# Altium schematic sheet Line_follower_Mark1.SchDoc
size A
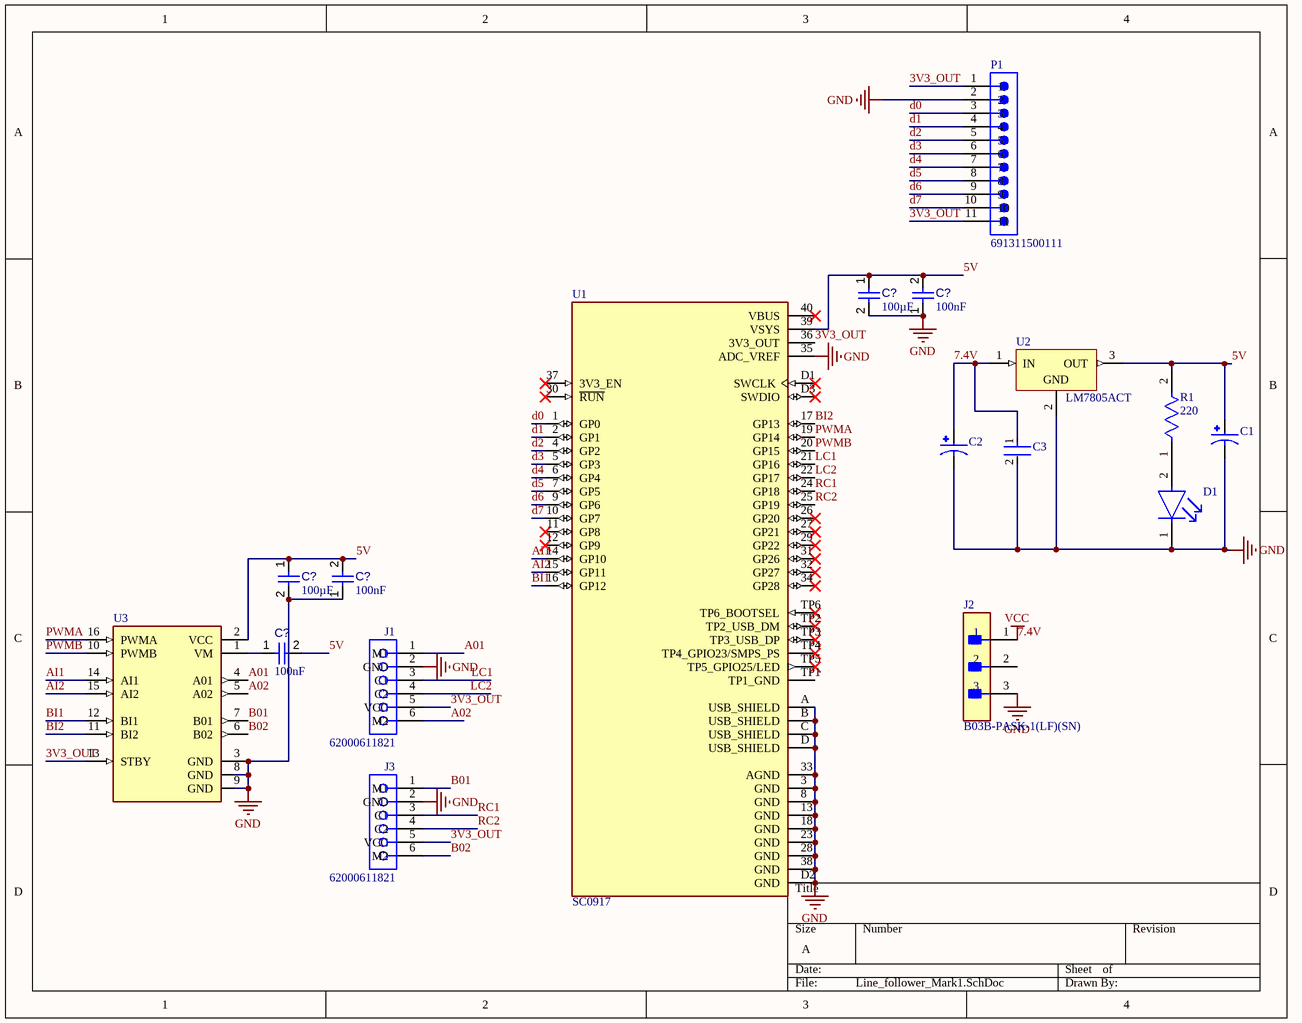
[diagram p0: Line_follower_Mark1.SchDoc]

## Parts
(Parts that share a designator on the sheet are numbered #1, #2 ... from top to bottom, then left to right.)
C1  EEUEB1H2R2S  [CAPPRD200W50D500H1100]  (value not drawn)
C2  EEUEB1H2R2S  [CAPPRD200W50D500H1100]  (value not drawn)
C3  RCER72A104K1K1H03B  [FP-RCE1K1-2_5-MFG]  (value not drawn)
C?#1  value 100µF  [CAPC0805(2012)145_L]  (hidden comment: Capacitor 100µF +/-20% 6.3V 0805)
C?#2  value 100nF  [CAPC0402(1005)60_L]  (hidden comment: Capacitor 100nF +/-20% 50V 0402)
C?#3  value 100µF  [CAPC0805(2012)145_L]  (hidden comment: Capacitor 100µF +/-20% 6.3V 0805)
C?#4  value 100nF  [CAPC0402(1005)60_L]  (hidden comment: Capacitor 100nF +/-20% 50V 0402)
C?#5  value 100nF  [CAPC0402(1005)60_L]  (hidden comment: Capacitor 100nF +/-20% 50V 0402)
D1  VSLB3940  [FP-VSLB3940-MFG]  (value not drawn)
J1  62000611821  [62000611821]
J2  B03B-PASK-1(LF)(SN)  [FP-B03B-PASK-1_LF_SN-MFG]
J3  62000611821  [62000611821]
P1  691311500111  [691311500111]
R1  220  [FP-MRS25-MFG]
U1  SC0917  [MODULE_SC0917]
U2  LM7805ACT  [FAIR-TO-220-3]
U3  (no value)  [MODULE_ROB-14450]

## Nets
7.4V: C2.P C3.1 J2.1 U2.1(IN)  [also labelled VCC]
GND: C1.N C2.N C3.2 C?#1.2 C?#2.1 C?#3.2 C?#4.1 D1.1(C) J1.2(GND) J2.3 J3.2(GND) P1.2 U1.3(GND) U1.8(GND) U1.13(GND) U1.18(GND) U1.23(GND) U1.28(GND) U1.33(AGND) U1.35(ADC_VREF) U1.38(GND) U1.A(USB_SHIELD) U1.B(USB_SHIELD) U1.C(USB_SHIELD) U1.D(USB_SHIELD) U1.D2(GND) U2.2(GND) U3.3(GND) U3.8(GND) U3.9(GND)
3V3_OUT: J1.5(VCC) J3.5(VCC) P1.1 P1.11 U1.36(3V3_OUT) U3.13(STBY)
5V: C1.P C?#1.1 C?#2.2 C?#3.1 C?#4.2 C?#5.2 R1.2 U1.39(VSYS) U2.3(OUT) U3.2(VCC)
A01: J1.1(M1) U3.4(A01)
A02: J1.6(M2) U3.5(A02)
AI1: U1.14(GP10) U3.14(AI1)
AI2: U1.15(GP11) U3.15(AI2)
B01: J3.1(M1) U3.7(B01)
B02: J3.6(M2) U3.6(B02)
BI1: U1.16(GP12) U3.12(BI1)
BI2: U1.17(GP13) U3.11(BI2)
d0: P1.3 U1.1(GP0)
d1: P1.4 U1.2(GP1)
d2: P1.5 U1.4(GP2)
d3: P1.6 U1.5(GP3)
d4: P1.7 U1.6(GP4)
d5: P1.8 U1.7(GP5)
d6: P1.9 U1.9(GP6)
d7: P1.10 U1.10(GP7)
LC1: J1.3(C1) U1.21(GP16)
LC2: J1.4(C2) U1.22(GP17)
PWMA: U1.19(GP14) U3.16(PWMA)
PWMB: U1.20(GP15) U3.10(PWMB)
RC1: J3.3(C1) U1.24(GP18)
RC2: J3.4(C2) U1.25(GP19)
NetC?#5_1: C?#5.1 U3.1(VM)
NetD1_2: D1.2(A) R1.1

Not connected (* = marked no-connect by the designer): J2 2; U1 11(GP8)* 12(GP9)* 26(GP20)* 27(GP21)* 29(GP22)* 30(~{RUN})* 31(GP26)* 32(GP27)* 34(GP28)* 37(3V3_EN)* 40(VBUS)* D1(SWCLK)* D3(SWDIO)* TP1(TP1_GND) TP2(TP2_USB_DM)* TP3(TP3_USB_DP)* TP4(TP4_GPIO23/SMPS_PS)* TP5(TP5_GPIO25/LED)* TP6(TP6_BOOTSEL)*

## Library data of the parts
C1 C2 = EEUEB1H2R2S: CAPACITOR, 2.2UF, 50V, 5X11MM; Capacitance:2.2F; Capacitance Tolerance: 20%; Voltage Rating:50V; Life Time @ Temperature:5000 hours @ 105C; Height:11mm; Diameter:5mm; Capacitor Terminals:Radial Leaded; Lead Spacing:2mm; Operating Temperature Range:-40C to +105C; AC Ripple Current:15mA; Capacitor Mounting:Through Hole; MF: Panasonic; Package: RADIAL-2 Panasonic; Availability: No availability data; MP: EEUEB1H2R2S; SnapEDA_Link: https://www.snapeda.com/parts/EEUEB1H2R2S/Panasonic/view-part/5793710/?ref=snap; Value: *; Check_prices: https://www.snapeda.com/parts/EEUEB1H2R2S/Panasonic/view-part/5793710/?ref=eda; Price: None
C3 = CMP-06035-011084-1: Cap Ceramic Monolithic 100nF 100V 10% Thru-Hole Bulk; Dielectric: X7R; Lead/Base Style: Formed Leads; Lead Diameter: 0.5mm; Resistor Type: Ceramic; Voltage Rating: 100V; Case/Package: Radial; Packaging: Bulk; Capacitance: 100nF; Lead Pitch: 0.197inch; Height - Seated (Max): 0.138inch; Voltage Rating (DC): 100V; Mount: Through Hole; Height: 3.5mm; Width: 0.098inch; Termination: Radial; Tolerance: 10%; Min Operating Temperature: -55°C; Package Quantity: 500; Max Operating Temperature: 125°C; Length: 0.157inch; Ratings: AEC-Q200
C?#1 C?#3 = CMP-001-00054-4: Chip Capacitor, 100µF +/-20%, 6.3V, 0805, Thickness 1.45 mm; Tolerance: 10%; Min Operating Temperature: -55°C; Max Operating Temperature: 85°C; Pins: 2; Mounting Technology: SMT; Case/Package: 0805; Voltage Rating: 6.3V
C?#2 C?#4 C?#5 = CMP-001-00067-3: Chip Capacitor, 100nF +/-20%, 50V, 0402, Thickness 0.6 mm; Tolerance: 10%; Min Operating Temperature: -55°C; Pins: 2; Case/Package: 0402; Max Operating Temperature: 85°C; Voltage Rating: 50V; Mounting Technology: SMT
D1 = CMP-00030-18785862-1: VSLB3940 940 nm 100 mA ±22° Through Hole High Speed Infrared Emitting Diode - T-1; Power Rating: 160mW; Rise Time: 15ns; Peak Wavelength: 940nm; Lens Style: Circular, Diffused, Round; Reverse Voltage: 5V; Viewing Angle: 44°; Forward Current: 100mA; Number of Elements: 1; Forward Voltage: 1.35V; Length: 3.2mm; Min Operating Temperature: -25°C; Radiation Hardening: No; Power Dissipation: 160mW; Lead Free: Lead Free; Orientation: Top View; Case/Package: T; Max Power Dissipation: 160mW; Max Operating Temperature: 85°C; Fall Time: 15ns; Number of Pins: 2; Test Current: 100mA; NexarPartId: 18785862; RoHS: Compliant; REACH SVHC: Unknown; Mount: Through Hole; Number of LEDs: 1; Wavelength: 940nm; Packaging: Bulk; Depth: 3.2mm
J1 J3 = CMP-03913-65162165-3: THT Vertical Socket Header WR-PHD, Pitch 2.00 mm, Single Row, 6 pins; Operating Supply Voltage: 250V; Gender: Female; Current Rating: 2A; Contact Resistance: 20mΩ; Number of Pins: 6; Orientation: Vertical; Lead Pitch: 2mm
J2 = CMP-17439-000193-1: CONN HEADER VERT 3POS 2MM; Voltage Rating: 250V; Current Rating: 3A; Mated Stacking Heights: 14.9mm; Number of Positions: 3; Packaging: Bulk; Contact Type: Male Pin; Flammability Rating: UL94 V-0; Contact Shape: Square; Number of Rows: 1; Color: Natural; Orientation: Straight; Housing Color: White; Fastening Type: Ramp; Insulation Material: PBT; Insulation Color: Natural; Mount: Through Hole; Contact Finish - Mating: TIN; Connector Type: Header; Termination: Solder; Contact Mating Length: 0.126inch; Lead Free: Lead Free; Contact Material: Copper Alloy; Pitch: 2mm; Series: PA; Number of Contacts: 3; Contact Plating: Tin
P1 = CMP-1502-02155-3: Terminal Block, Header, 11Pos, Th Rohs Compliant: Yes
R1 = CMP-00030-42757237-1: MRS25000C1000FRP00 Resistor, 220 Ohm, ± 1%, 600 mW, Axial Leaded, Metal Film (Thin Film), Professional; Max Power Dissipation: 600mW; Resistance: 220Ω; Voltage Rating: 350V; Temperature Coefficient: 50ppm/°C; Lead Diameter: 600µm; RoHS: Compliant; Radiation Hardening: No; Schedule B: 8533210090, 8533210090; Length: 6.5mm; Packaging: Tape & Reel (TR); Number of Terminations: 2; Mount: Through Hole; Width: 2.5mm; Tolerance: 1%; Military Standard: Not; Voltage Rating (DC): 350V; Contact Plating: Tin; Number of Pins: 2; Max Operating Temperature: 155°C; NexarPartId: 42757237; Diameter: 2.5mm; Composition: Metal Film, Thin Film; REACH SVHC: Unknown; Power Rating: 600mW; Lead Free: Lead Free; Termination: Axial; Case/Package: Axial; Min Operating Temperature: -55°C
U1 = SC0917: RP2040 Raspberry Pi Pico - ARMÂ® CortexÂ®-M0+ MCU 32-Bit Embedded Evaluation Board; SnapEDA_Link: https://www.snapeda.com/parts/SC0917/Raspberry+Pi/view-part/?ref=snap; Package: None; Value: *; MF: Raspberry Pi; MP: SC0917; Check_prices: https://www.snapeda.com/parts/SC0917/Raspberry+Pi/view-part/?ref=eda
U2 = CMP-2000-04937-1: Positive Voltage Regulator, 5 V, 1 A, 0 to 125 degC, 3-Pin TO-220, RoHS, Tube; Manufacturer: Fairchild; Number of Outputs: 1; Typical Dropout Voltage @ Current: 2V@1A; Output Type: Fixed; Output Voltage: 5V; Quiescent Current: 6mA; Dropout Voltage Measurement Current: 1A; Line Regulation: 50mV; Maximum Input Voltage: 35V; Regulator Function: Linear; Load Regulation: 100mV; Package Type: TO-220; Mounting Type: ThroughHole; Height: 16.51mm; Maximum Operating Temperature: +125degC; Datasheet Version: Rev. 1.0.1, 05/2006; Package Reference: TO-220; Minimum Operating Temperature: 0degC; Manufacturer URL: https://www.fairchildsemi.com/; Package URL: https://www.fairchildsemi.com/package-drawings/TO/TO220B03.pdf; Length: 10.67mm; Series: LM78xx; Dimensions: 10.67x4.83x16.51mm; Polarity: Positive; Maximum Output Current: 1A; Pin Count: 3; Width: 4.83mm; Package Description: 3-Pin Through Hole Device, Body 10 x 4.5 mm, Pitch 2.54 mm; Datasheet URL: https://datasheet.ciiva.com/5816/1359194-5816420.pdf
U3 = ROB-14450: TB6612FNG Motor Controller/Driver Power Management Evaluation Board; MF: SparkFun Electronics; Check_prices: https://www.snapeda.com/parts/ROB-14450/SparkFun%20Electronics/view-part/2656367/?ref=eda; Package: None; MP: ROB-14450; Value: *; Availability: In Stock; SnapEDA_Link: https://www.snapeda.com/parts/ROB-14450/SparkFun%20Electronics/view-part/2656367/?ref=snap; Price: None